# Altium schematic sheet 3V3_LDO.SchDoc
size A
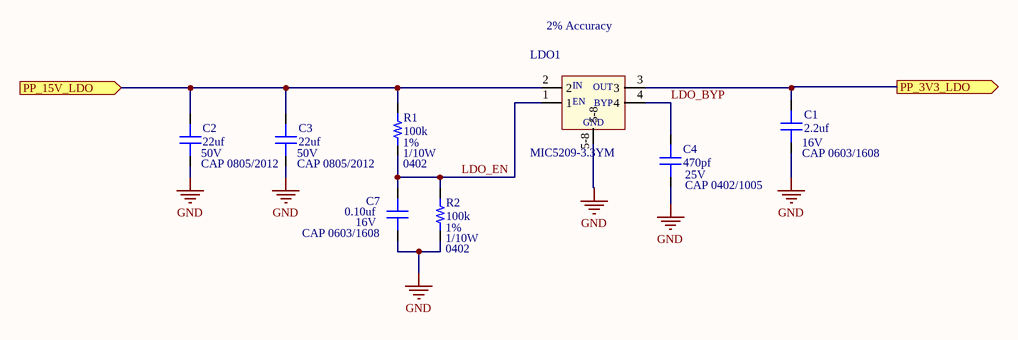
[diagram p0: 3V3_LDO.SchDoc]

## Parts
C1  value 2.2uf  Voltage_Rating: 16V  [CAP 0603/1608]  (hidden comment: Capacitor MLCC 2.2uf 16V CAP 0603/1608)
C2  value 22uf  Voltage_Rating: 50V  [CAP 0805/2012]  (hidden comment: Capacitor MLCC 22uf 50V CAP 0805/2012)
C3  value 22uf  Voltage_Rating: 50V  [CAP 0805/2012]  (hidden comment: Capacitor MLCC 22uf 50V CAP 0805/2012)
C4  value 470pf  Voltage_Rating: 25V  [CAP 0402/1005]  (hidden comment: Capacitor MLCC 470pf 25V CAP 0402/1005)
C7  value 0.10uf  Voltage_Rating: 16V  [CAP 0603/1608]  (hidden comment: Capacitor MLCC 0.10uf 16V CAP 0603/1608)
LDO1  MIC5209-3.3YM  [SOIC-8]
R1  value 100k  Tolerance: 1%  Power: 1/10W  Package: 0402  [RES 0402/1005]  (hidden comment: Resistor 100k 0402 1/10W 1%)
R2  value 100k  Tolerance: 1%  Power: 1/10W  Package: 0402  [RES 0402/1005]  (hidden comment: Resistor 100k 0402 1/10W 1%)

## Ports
PP_3V3_LDO (out), PP_15V_LDO (in)

## Nets
GND: C1.1 C2.1 C3.1 C4.1 C7.1 LDO1.5-8 R2.1
LDO_BYP: C4.2 LDO1.4
LDO_EN: C7.2 LDO1.1 R1.1 R2.2
PP_3V3_LDO: C1.2 LDO1.3 ; port PP_3V3_LDO
PP_15V_LDO: C2.2 C3.2 LDO1.2 R1.2 ; port PP_15V_LDO

## Notes on the sheet
- 2% Accuracy
- (in symbol 2) OUT; IN; BYP; EN; GND

## Library data of the parts
C1 = 231: Manufacturer_id: 1; idCapacitor: 231; Name: Cap_2.2uf_16V_CAP 0603/1608; Dielectric: Ceramic; Created_By: Nick Mah; Drawer_id: 1; Package: CAP 0603/1608; Created_Date: 10/20/2018
C2 C3 = 1077: Manufacturer_id: 1; idCapacitor: 1077; Name: Cap_22uf_50V_CAP 0805/2012; Dielectric: Ceramic; Created_By: Nick Mah; Drawer_id: 1; Package: CAP 0805/2012; Created_Date: 10/20/2018
C4 = 425: Manufacturer_id: 1; idCapacitor: 425; Name: Cap_470pf_25V_CAP 0402/1005; Dielectric: Ceramic; Created_By: Nick Mah; Drawer_id: 1; Package: CAP 0402/1005; Created_Date: 10/20/2018
C7 = 223: Manufacturer_id: 1; idCapacitor: 223; Name: Cap_0.10uf_16V_CAP 0603/1608; Dielectric: Ceramic; Created_By: Nick Mah; Drawer_id: 1; Package: CAP 0603/1608; Created_Date: 10/20/2018
LDO1 = 2: IC REG LINEAR 3.3V 500MA 8SOIC; Manufacturer_id: 1; MfrPartNo: MIC5209-3.3YM-TRYM; idPMIC_SW: 2; Name: MIC5209-3.3YM 3.3V 500mA LDO; Output_Config: Fixed; Vin(Min): 2.5V; Vin(Max): 16V; Drawer_id: 1; Value: 3.3V 500mA; Num_Outputs: 1; Vout(Min): 3.3v; Vout(Max): 3.3V; Current_Rating: 500mA; Package: SOIC-8; Link: https://www.digikey.com/product-detail/en/microchip-technology/MIC5209-3.3YM-TR/MIC5209-3.3YM-CT-ND/7916551
R1 R2 = 121: Manufacturer_id: 1; idResistor: 121; Name: Res_100k_0402_1/10W_1%; Created_By: Nick Mah; Supplier 1: Digi-Key; Drawer_id: 1; ComponentLink1Description: Datasheet; Created_Date: 2018-10-20